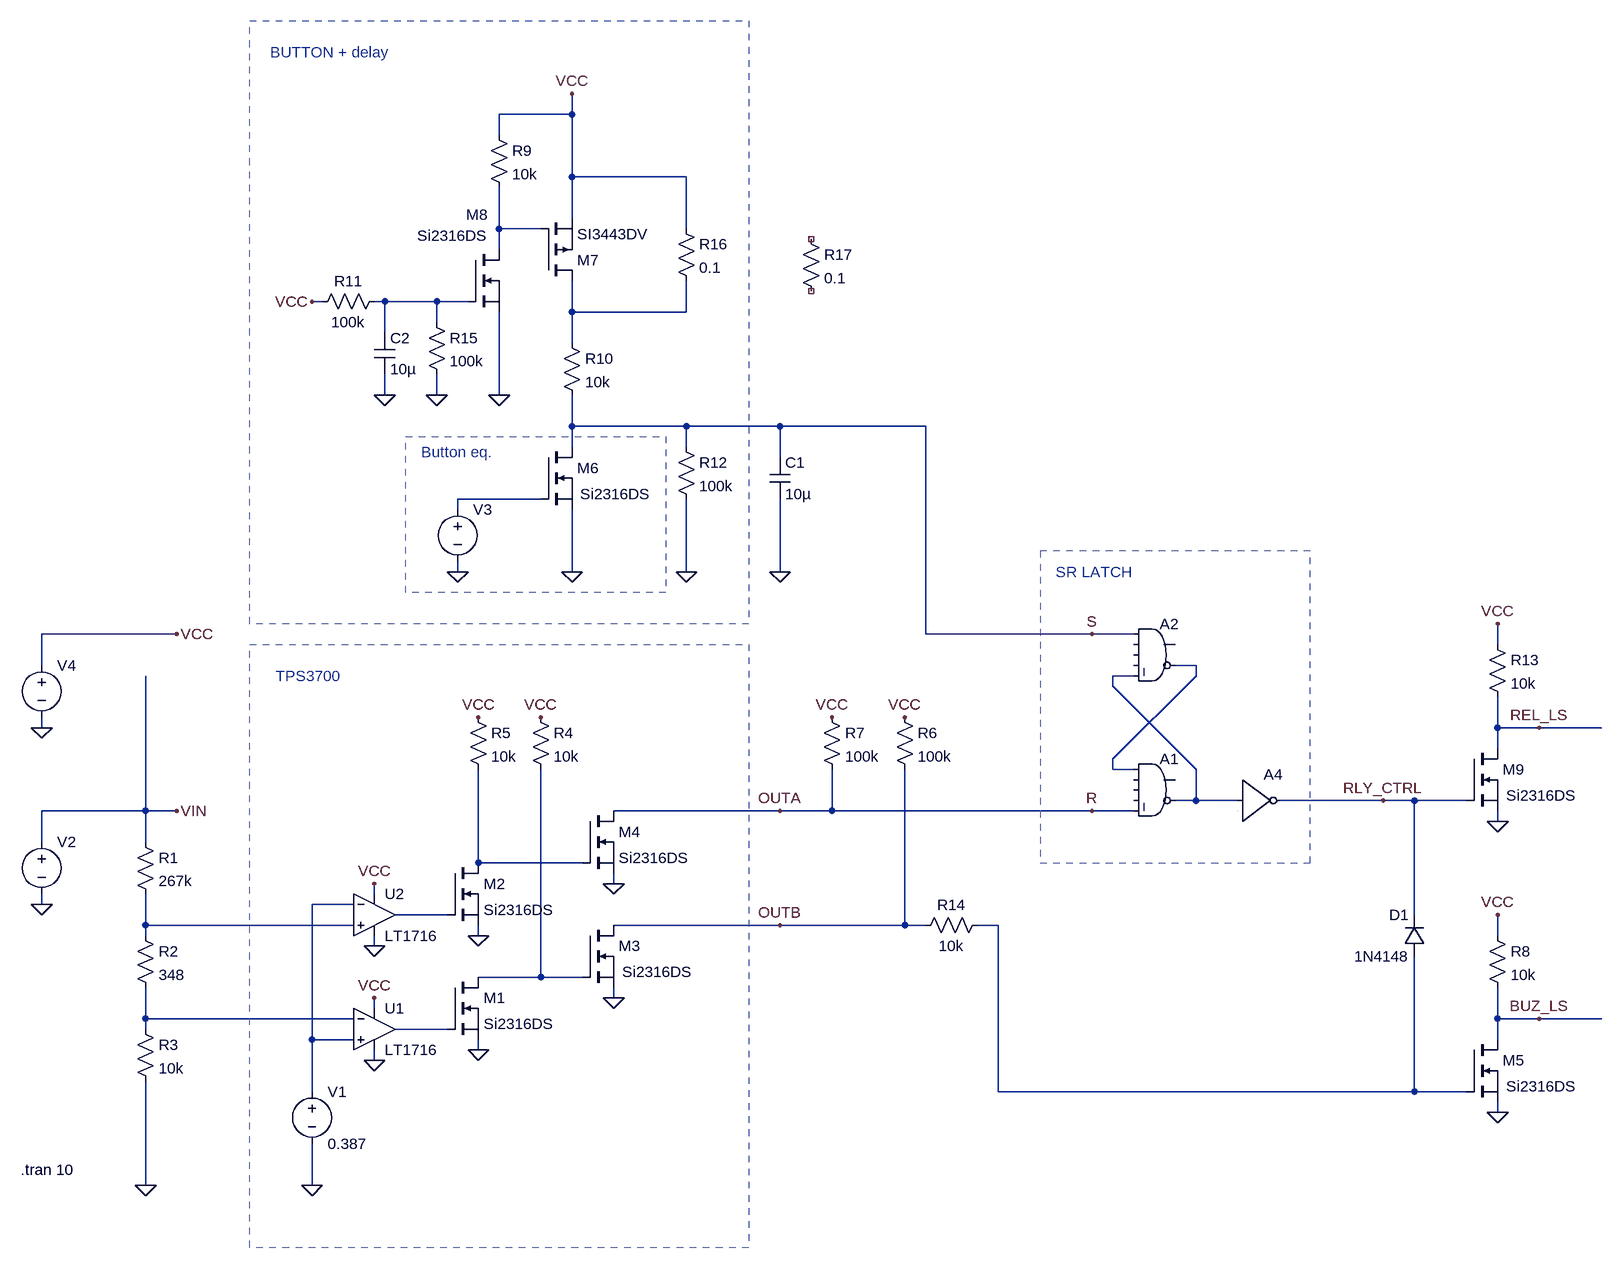
[diagram p0: schematic UVLO_TEST_OLD.asc]
UVLO_TEST_OLD.asc, the LTspice schematic file:
Version 4
SHEET 1 2388 692
WIRE 496 -1056 496 -1088
WIRE 496 -1056 384 -1056
WIRE 384 -1024 384 -1056
WIRE 496 -960 496 -1056
WIRE 672 -960 496 -960
WIRE 496 -896 496 -960
WIRE 384 -880 384 -944
WIRE 448 -880 384 -880
WIRE 672 -880 672 -960
WIRE 384 -848 384 -880
WIRE 112 -768 96 -768
WIRE 208 -768 192 -768
WIRE 288 -768 208 -768
WIRE 336 -768 288 -768
WIRE 496 -752 496 -800
WIRE 672 -752 672 -800
WIRE 672 -752 496 -752
WIRE 288 -736 288 -768
WIRE 208 -720 208 -768
WIRE 496 -704 496 -752
WIRE 208 -624 208 -656
WIRE 288 -624 288 -656
WIRE 384 -624 384 -752
WIRE 496 -576 496 -624
WIRE 672 -576 496 -576
WIRE 816 -576 672 -576
WIRE 1040 -576 816 -576
WIRE 496 -544 496 -576
WIRE 672 -544 672 -576
WIRE 816 -528 816 -576
WIRE 448 -464 320 -464
WIRE 320 -448 320 -464
WIRE 320 -352 320 -368
WIRE 496 -352 496 -448
WIRE 672 -352 672 -464
WIRE 816 -352 816 -464
WIRE -112 -256 -320 -256
WIRE 1040 -256 1040 -576
WIRE 1296 -256 1040 -256
WIRE 1360 -256 1296 -256
WIRE 1920 -240 1920 -272
WIRE -320 -208 -320 -256
WIRE 1456 -208 1424 -208
WIRE 1360 -192 1328 -192
WIRE 1456 -192 1456 -208
WIRE 1328 -176 1328 -192
WIRE -320 -112 -320 -128
WIRE 1920 -112 1920 -160
WIRE 1984 -112 1920 -112
WIRE 2080 -112 1984 -112
WIRE 1920 -80 1920 -112
WIRE 1328 -64 1456 -192
WIRE 1328 -48 1328 -64
WIRE 1360 -48 1328 -48
WIRE 1456 -48 1328 -176
WIRE 1456 0 1456 -48
WIRE 1456 0 1424 0
WIRE 1520 0 1456 0
WIRE 1744 0 1584 0
WIRE 1792 0 1744 0
WIRE 1872 0 1792 0
WIRE -160 16 -160 -192
WIRE -160 16 -320 16
WIRE -112 16 -160 16
WIRE 816 16 560 16
WIRE 896 16 896 -48
WIRE 896 16 816 16
WIRE 1296 16 896 16
WIRE 1360 16 1296 16
WIRE 1920 32 1920 16
WIRE -320 64 -320 16
WIRE -160 64 -160 16
WIRE 352 96 352 -48
WIRE 512 96 352 96
WIRE 560 128 560 112
WIRE 192 144 192 128
WIRE -320 160 -320 144
WIRE 160 160 96 160
WIRE 304 176 224 176
WIRE 1792 176 1792 0
WIRE -160 192 -160 144
WIRE 160 192 -160 192
WIRE 816 192 560 192
WIRE 1008 192 1008 -48
WIRE 1008 192 816 192
WIRE 1040 192 1008 192
WIRE 1152 192 1120 192
WIRE -160 208 -160 192
WIRE 352 208 352 192
WIRE 1920 208 1920 176
WIRE 192 224 192 208
WIRE 448 272 448 -48
WIRE 448 272 352 272
WIRE 512 272 448 272
WIRE 560 304 560 288
WIRE 192 320 192 304
WIRE -160 336 -160 288
WIRE 160 336 -160 336
WIRE 1920 336 1920 288
WIRE 1984 336 1920 336
WIRE 2080 336 1984 336
WIRE -160 352 -160 336
WIRE 304 352 224 352
WIRE 96 368 96 160
WIRE 160 368 96 368
WIRE 1920 368 1920 336
WIRE 352 384 352 368
WIRE 192 400 192 384
WIRE 96 448 96 368
WIRE 1152 448 1152 192
WIRE 1792 448 1792 240
WIRE 1792 448 1152 448
WIRE 1872 448 1792 448
WIRE 1920 480 1920 464
WIRE -160 592 -160 432
WIRE 96 592 96 528
FLAG -160 592 0
FLAG -320 160 0
FLAG 96 592 0
FLAG 192 400 0
FLAG 192 224 0
FLAG 192 304 VCC
FLAG 192 128 VCC
FLAG -112 16 VIN
FLAG 352 384 0
FLAG 448 -128 VCC
FLAG 352 208 0
FLAG 352 -128 VCC
FLAG 560 304 0
FLAG 1008 -128 VCC
FLAG 560 128 0
FLAG 896 -128 VCC
FLAG 816 192 OUTB
FLAG 1920 480 0
FLAG 1920 176 VCC
FLAG 816 16 OUTA
FLAG 1984 336 BUZ_LS
FLAG 496 -352 0
FLAG 320 -352 0
FLAG 1296 -256 S
FLAG 1296 16 R
FLAG 496 -1088 VCC
FLAG 384 -624 0
FLAG 208 -624 0
FLAG 96 -768 VCC
FLAG 672 -352 0
FLAG 1920 32 0
FLAG 1920 -272 VCC
FLAG 1984 -112 REL_LS
FLAG 288 -624 0
FLAG 816 -352 0
FLAG -320 -112 0
FLAG -112 -256 VCC
FLAG 1744 0 RLY_CTRL
SYMBOL res -176 48 R0
SYMATTR InstName R1
SYMATTR Value 267k
SYMBOL res -176 192 R0
SYMATTR InstName R2
SYMATTR Value 348
SYMBOL res -176 336 R0
SYMATTR InstName R3
SYMATTR Value 10k
SYMBOL voltage 96 432 R0
WINDOW 123 0 0 Left 0
WINDOW 39 0 0 Left 0
SYMATTR InstName V1
SYMATTR Value 0.387
SYMBOL Comparators\\LT1716 192 352 R0
SYMATTR InstName U1
SYMBOL Comparators\\LT1716 192 176 R0
SYMATTR InstName U2
SYMBOL voltage -320 48 R0
WINDOW 3 24 96 Invisible 2
WINDOW 123 0 0 Left 0
WINDOW 39 0 0 Left 0
SYMATTR Value PWL(0 0 0.01 12 3 12 4 10 5 12 6 12 7 10 10 10)
SYMATTR InstName V2
SYMBOL nmos 304 272 R0
SYMATTR InstName M1
SYMATTR Value Si2316DS
SYMBOL res 432 -144 R0
SYMATTR InstName R4
SYMATTR Value 10k
SYMBOL nmos 304 96 R0
SYMATTR InstName M2
SYMATTR Value Si2316DS
SYMBOL res 336 -144 R0
SYMATTR InstName R5
SYMATTR Value 10k
SYMBOL nmos 512 192 R0
WINDOW 3 61 72 Left 2
SYMATTR Value Si2316DS
SYMATTR InstName M3
SYMBOL res 992 -144 R0
SYMATTR InstName R6
SYMATTR Value 100k
SYMBOL nmos 512 16 R0
SYMATTR InstName M4
SYMATTR Value Si2316DS
SYMBOL res 880 -144 R0
SYMATTR InstName R7
SYMATTR Value 100k
SYMBOL nmos 1872 368 R0
WINDOW 3 61 72 Left 2
SYMATTR Value Si2316DS
SYMATTR InstName M5
SYMBOL res 1904 192 R0
SYMATTR InstName R8
SYMATTR Value 10k
SYMBOL Digital\\and 1392 -80 R0
SYMATTR InstName A1
SYMATTR SpiceLine Vhigh = 5
SYMBOL Digital\\and 1392 -288 R0
SYMATTR InstName A2
SYMATTR Value2 2
SYMATTR SpiceLine Vhigh = 5
SYMBOL nmos 448 -544 R0
WINDOW 3 61 72 Left 2
SYMATTR Value Si2316DS
SYMATTR InstName M6
SYMBOL voltage 320 -464 R0
WINDOW 3 24 96 Invisible 2
WINDOW 123 0 0 Left 0
WINDOW 39 0 0 Left 0
SYMATTR Value PULSE(0 5 2.5 0.001 0.001 0.1 3 5)
SYMATTR InstName V3
SYMBOL res 480 -720 R0
SYMATTR InstName R10
SYMATTR Value 10k
SYMBOL Digital\\inv 1520 -64 R0
SYMATTR InstName A4
SYMATTR SpiceLine Vhigh = 5
SYMBOL nmos 336 -848 R0
WINDOW 3 -78 -21 Left 2
WINDOW 0 -3 -54 Left 2
SYMATTR Value Si2316DS
SYMATTR InstName M8
SYMBOL res 368 -1040 R0
SYMATTR InstName R9
SYMATTR Value 10k
SYMBOL cap 192 -720 R0
SYMATTR InstName C2
SYMATTR Value 10µ
SYMBOL res 208 -784 R90
WINDOW 0 0 56 VBottom 2
WINDOW 3 32 56 VTop 2
SYMATTR InstName R11
SYMATTR Value 100k
SYMBOL res 656 -560 R0
SYMATTR InstName R12
SYMATTR Value 100k
SYMBOL diode 1808 240 R180
WINDOW 0 24 64 Left 2
WINDOW 3 24 0 Left 2
SYMATTR InstName D1
SYMATTR Value 1N4148
SYMBOL res 1136 176 R90
WINDOW 0 0 56 VBottom 2
WINDOW 3 32 56 VTop 2
SYMATTR InstName R14
SYMATTR Value 10k
SYMBOL nmos 1872 -80 R0
WINDOW 3 61 72 Left 2
SYMATTR Value Si2316DS
SYMATTR InstName M9
SYMBOL res 1904 -256 R0
SYMATTR InstName R13
SYMATTR Value 10k
SYMBOL res 272 -752 R0
SYMATTR InstName R15
SYMATTR Value 100k
SYMBOL pmos 448 -800 M180
SYMATTR InstName M7
SYMATTR Value SI3443DV
SYMBOL cap 800 -528 R0
SYMATTR InstName C1
SYMATTR Value 10µ
SYMBOL voltage -320 -224 R0
WINDOW 3 24 96 Invisible 2
WINDOW 123 0 0 Left 0
WINDOW 39 0 0 Left 0
SYMATTR Value PWL(0 0 0.01 5)
SYMATTR InstName V4
SYMBOL res 848 -880 R0
SYMATTR InstName R17
SYMATTR Value 0.1
SYMBOL res 656 -896 R0
SYMATTR InstName R16
SYMATTR Value 0.1
TEXT -352 568 Left 2 !.tran 10
TEXT 40 -192 Left 2 ;TPS3700
TEXT 1240 -352 Left 2 ;SR LATCH
TEXT 32 -1152 Left 2 ;BUTTON + delay
TEXT 264 -536 Left 2 ;Button eq.
RECTANGLE Normal 1632 -384 1216 96 1
RECTANGLE Normal 0 -1200 768 -272 1
RECTANGLE Normal 0 -240 768 688 1
RECTANGLE Normal 240 -560 640 -320 1

The netlist it stands for:
* UVLO_TEST_OLD.asc
R1 VIN N010 267k
R2 N010 N013 348
R3 N013 0 10k
V1 N008 0 0.387
XU1 N008 N013 VCC 0 N014 LT1716  ; pins In+ In- V+ V- OUT
XU2 N010 N008 VCC 0 N009 LT1716  ; pins In+ In- V+ V- OUT
V2 VIN 0 PWL(0 0 0.01 12 3 12 4 10 5 12 6 12 7 10 10 10)
M1 N012 N014 0 0 Si2316DS
R4 VCC N012 10k
M2 N007 N009 0 0 Si2316DS
R5 VCC N007 10k
M3 OUTB N012 0 0 Si2316DS
R6 VCC OUTB 100k
M4 R N007 0 0 Si2316DS
R7 VCC R 100k
M5 BUZ_LS N011 0 0 Si2316DS
R8 VCC BUZ_LS 10k
A1 N005 0 0 0 R N006 0 0 AND Vhigh = 5
A2 S 0 0 0 N006 N005 0 0 AND 2 Vhigh = 5
M6 S N004 0 0 Si2316DS
V3 N004 0 PULSE(0 5 2.5 0.001 0.001 0.1 3 5)
R10 N003 S 10k
A4 N006 0 0 0 0 RLY_CTRL 0 0 BUF Vhigh = 5
M8 N001 N002 0 0 Si2316DS
R9 VCC N001 10k
C2 N002 0 10µ
R11 N002 VCC 100k
R12 S 0 100k
D1 N011 RLY_CTRL 1N4148
R14 N011 OUTB 10k
M9 REL_LS RLY_CTRL 0 0 Si2316DS
R13 VCC REL_LS 10k
R15 N002 0 100k
M7 N003 N001 VCC VCC SI3443DV
C1 S 0 10µ
V4 VCC 0 PWL(0 0 0.01 5)
R17 NC_01 NC_02 0.1
R16 VCC N003 0.1
.model D D
.lib standard.dio
.model NMOS NMOS
.model PMOS PMOS
.lib standard.mos
.tran 10
* TPS3700
* SR LATCH
* BUTTON + delay
* Button eq.
.lib LTC1.lib
.backanno
.end